# Altium schematic sheet Detect_IR_v2_SCH.SchDoc
size A4; SheetNumber: 1; SheetTotal: 1
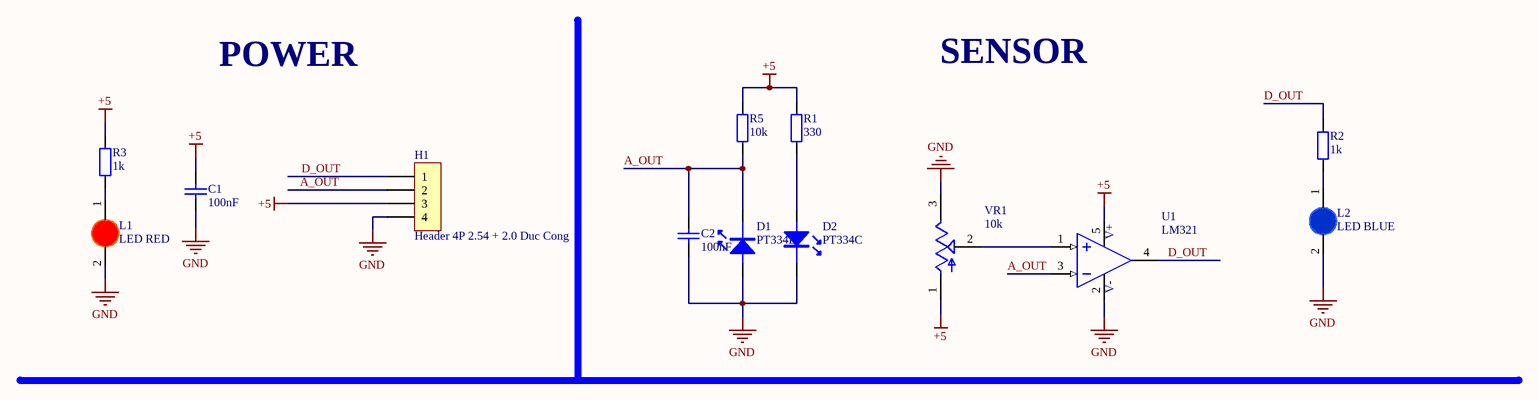
[diagram p0: Detect_IR_v2_SCH.SchDoc]

## Parts
C1  100nF  [tu 0603]
C2  100nF  [tu 0603]
D1  PT334B  [LED_CIRCLE_DIP_2P_5MM]
D2  PT334C  [LED_CIRCLE_DIP_2P_5MM]
H1  Header 4P 2.54 + 2.0 Duc Cong  [Header 4P DC 2.54 + 2.0]
L1  LED RED  [LED-0805-Red]
L2  LED BLUE  [LED-0805-Blue]
R1  330  [tro smd 0603]
R2  1k  [tro smd 0603]
R3  1k  [tro smd 0603]
R5  10k  [tro smd 0603]
U1  LM321  [sot23-5]
VR1  10k  [TRIM_3362P-1-102]

## Nets
+5: C1.1 H1.3 R1.2 R3.2 R5.2 U1.5(V+) VR1.1(CCW)
GND: C1.2 C2.2 D1.1 D2.2 H1.4 L1.2(K) L2.2(K) U1.2(V-) VR1.3(CW)
A_OUT: C2.1 D1.2 H1.2 R5.1 U1.3(IN-)
D_OUT: H1.1 R2.2 U1.4(-V)
NetD2_1: D2.1 R1.1
NetL1_1: L1.1(A) R3.1
NetL2_1: L2.1(A) R2.1
NetU1_1: U1.1(IN+) VR1.2(WIPER)

## Notes on the sheet
- POWER
- SENSOR

## Library data of the parts
C1 C2 = Tu 0603 104 50V 10%: Dán; Don_Vi: Con; So_Chan: 2; Ten_Linh_Kien: Tụ 0603 104-100nF 10% 50V; Ma_Hang: MH004568; Chung_Loai: Dán; Kieu_Chan: *
D1 D2 = LED_DIP_2P: Led
H1 = Header 4P 2.54 + 2.0 Duc Cong: Cắm; Ten_Linh_Kien: Header 4P XH2.54-4P Đực Cong; Don_Vi: Con; Ma_Hang: MH001310; Chung_Loai: Cắm
L1 = LED 0805 Do: Dán; Don_Vi: Con; Ma_Hang: MH000897; Ten_Linh_Kien: LED 0805 Màu Đỏ (Red); Ghi_Chu: *; Kieu_Chan: *; Chung_Loai: Dán
L2 = LED 0805 Xanh Duong: Dán; Don_Vi: Con; Ma_Hang: MH002327; Ten_Linh_Kien: LED 0805 Màu Xanh Dương (Blue); Ghi_Chu: *; Kieu_Chan: *; Chung_Loai: Dán
R1 R5 = Tro 0603 1% 10k: Dán; Don_Vi: Con; So_Chan: 2; Ten_Linh_Kien: Trở 0603 1% 10k; Ma_Hang: MH006333; Chung_Loai: Dán; Kieu_Chan: *
R2 R3 = Tro 0603 1% 1k: Dán; So_Chan: 2; Don_Vi: Con; Ten_Linh_Kien: Trở 0603 1% 1k; Ma_Hang: MH006334; Chung_Loai: Dán; Kieu_Chan: *
U1 = LM321: Opamp
VR1 = Bien tro vuong: TRIMMER - 1/4in SQ ST CERMET | Bourns 3362P-1-102; SnapEDA_Link: https://www.snapeda.com/parts/3362P-1-102/Bourns/view-part/?ref=snap; Package: 3362P-1 Bourns Inc.; Value: *; MF: Bourns; MP: 3362P-1-102; Check_prices: https://www.snapeda.com/parts/3362P-1-102/Bourns/view-part/?ref=eda